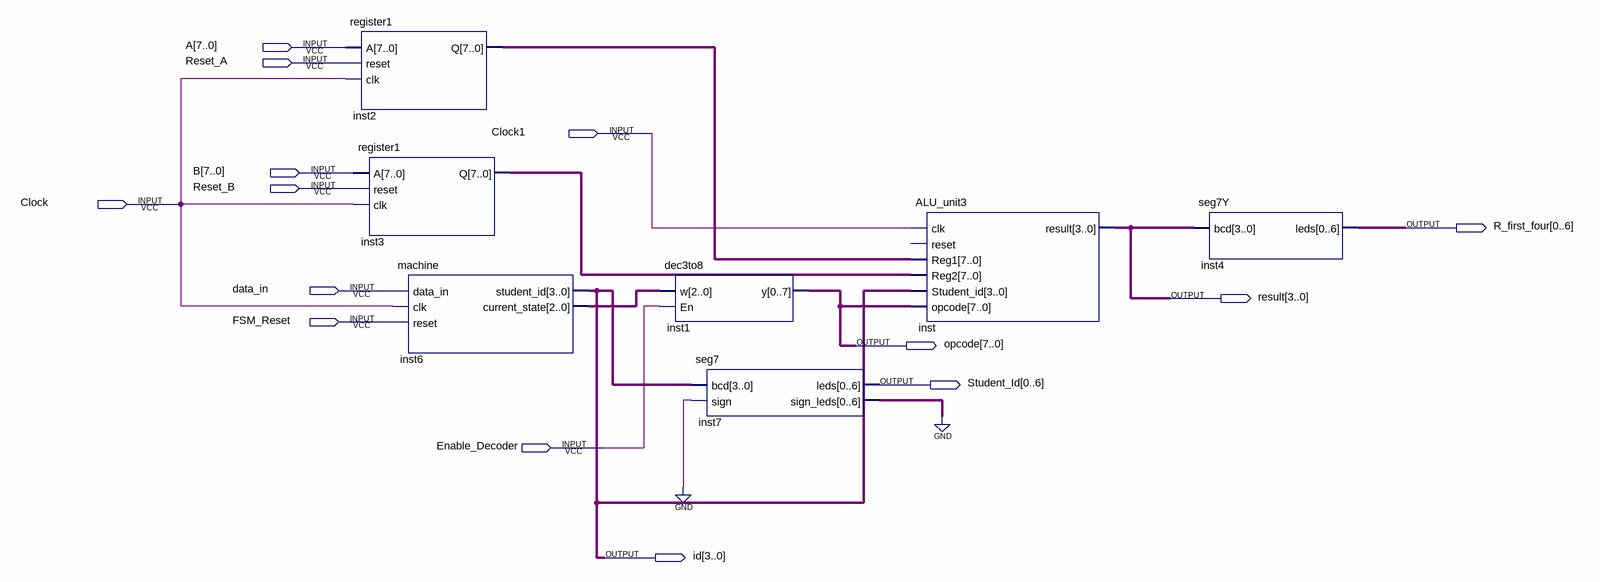
[diagram p0: schematic sheet]
// Quartus schematic Q.bdf as structural Verilog: 7 symbols, 14 pins
module Q (
  input  [7:0] A,
  input  Reset_A,
  input  Clock1,
  input  [7:0] B,
  input  Reset_B,
  input  Clock,
  input  data_in,
  input  FSM_Reset,
  input  Enable_Decoder,
  output [0:6] R_first_four,
  output [3:0] result,
  output [7:0] opcode,
  output [0:6] Student_Id,
  output [3:0] id
);

  wire [2:0] inst6_current_state;
  wire [6:0] inst7_sign_leds;
  wire [7:0] inst2_q, inst3_q;

  register1 inst2 (.A(A), .reset(Reset_A), .clk(Clock), .Q(inst2_q));
  register1 inst3 (.A(B), .reset(Reset_B), .clk(Clock), .Q(inst3_q));
  machine inst6 (
    .data_in(data_in), .clk(Clock), .reset(FSM_Reset), .student_id(id), .current_state(inst6_current_state));
  dec3to8 inst1 (.w(inst6_current_state), .En(Enable_Decoder), .y(opcode));
  seg7 inst7 (.bcd(id), .sign(1'b0), .leds(Student_Id), .sign_leds(inst7_sign_leds));
  ALU_unit3 inst (
    .clk(Clock1), .Reg1(inst2_q), .Reg2(inst3_q), .Student_id(id), .opcode(opcode), .result(result));  // open: reset
  seg7Y inst4 (.bcd(result), .leds(R_first_four));
  // also tied to GND on the sheet: {inst7_sign_leds[0], inst7_sign_leds[1], inst7_sign_leds[2], inst7_sign_leds[3], inst7_sign_leds[4], inst7_sign_leds[5], inst7_sign_leds[6]}
endmodule
